# EAGLE design fonte_schema (EAGLE 9.6.2)
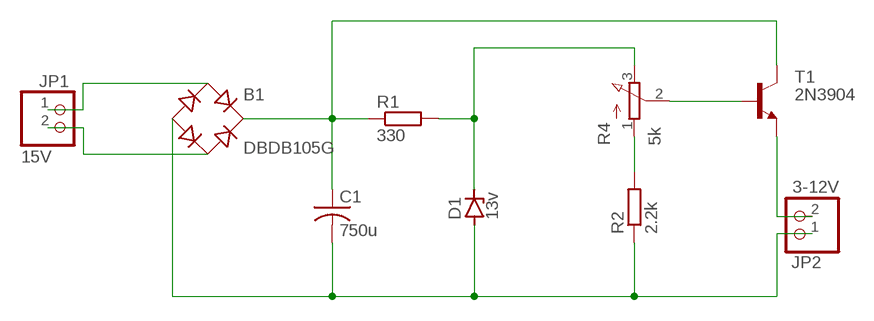
[diagram p0: schematic, sheet 1]

## Parts
B1  DBDB105G  [DB]
C1  750u  C-US025-025X050  [C025-025X050]
D1  13v  BZD23  [SOD81]
JP1  15V  PINHD-1X2  [1X02]
JP2  3-12V  PINHD-1X2  [1X02]
R1  330  R-EU_0204/7  [0204/7]
R2  2.2k  R-EU_0204/7  [0204/7]
R4  5k  3RP/1610N  [3RP/1610N]
T1  2N3904  [TO92]

## Nets
N$1: JP2.2 T1.3(E)
N$2: B1.AC1 JP1.1
N$3: B1.+ C1.1 R1.1 T1.1(C)
N$4: D1.C R1.2 R4.3(E)
N$5: B1.AC2 JP1.2
N$6: R4.2(S) T1.2(B)
N$7: R2.2 R4.1(A)
N$8: B1.- C1.2 D1.A JP2.1 R2.1

## Library data of the parts
B1 = rectifier:DB?*G: Single Phase 1.0 AMP Glass Passivated Bridge Rectifier Taiwan Semiconductor Co.,Ltd. - TSC Source: http://www.taiwansemi.com/TSCbig5/ezcatfiles/cust/img/img/db101g.pdf http://www.ts.com.tw/db/pictures/modules/PDT/PDT060207001/DBLS201G.pdf
C1 = rcl:C-US: CAPACITOR, American symbol; SPICEPREFIX: C
D1 = diode:BZD23: Z DIODE; SPICEPREFIX: D
JP1 JP2 = pinhead:PINHD-1X2: PIN HEADER; SPICEPREFIX: H
R1 R2 = rcl:R-EU_: RESISTOR, European symbol; SPICEPREFIX: R
R4 = pot:3RP/1610N: 16mm Potentiometer one level Source: http://www.alphapotentiometers.net/html/16mm_pot_2.html; SPICEPREFIX: J
T1 = transistor:2N3904: NPN TRANSISTOR; SPICEPREFIX: J

## Board
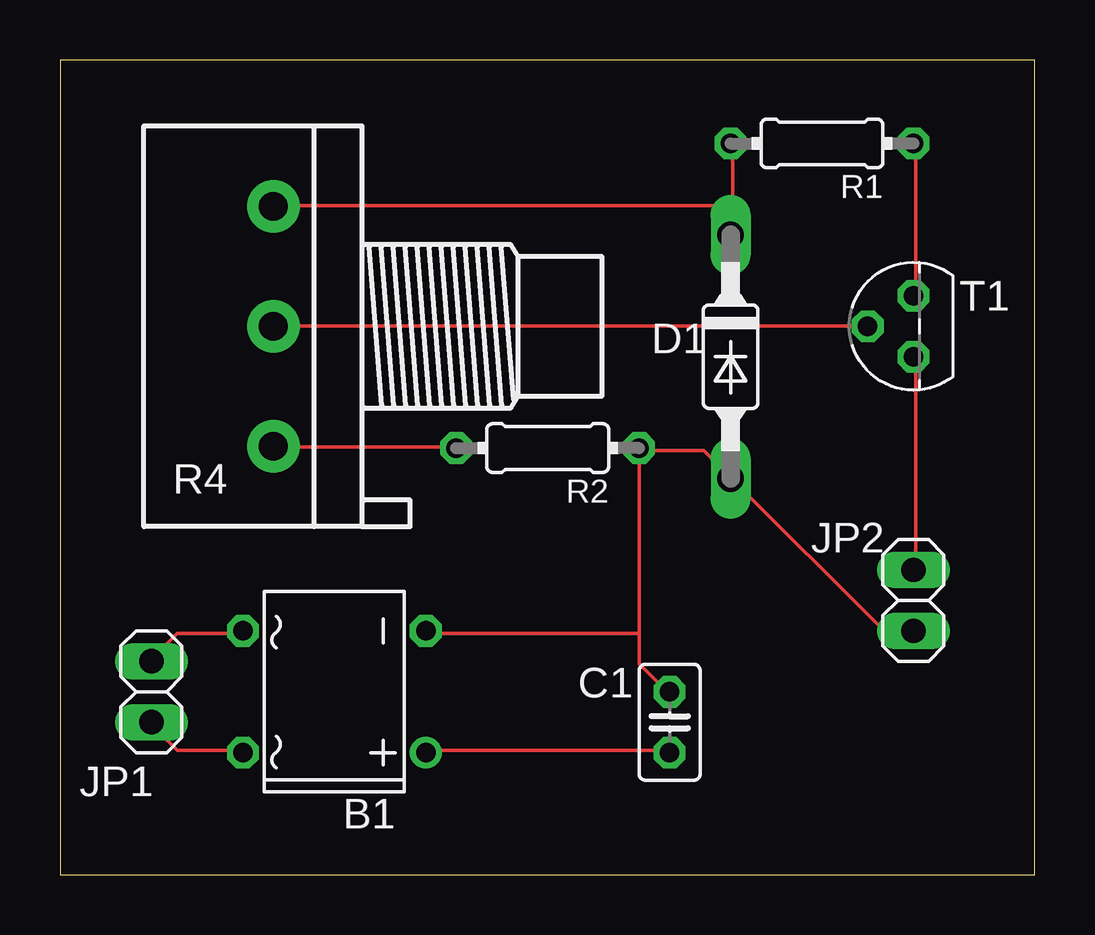
[diagram p1: board, top side]
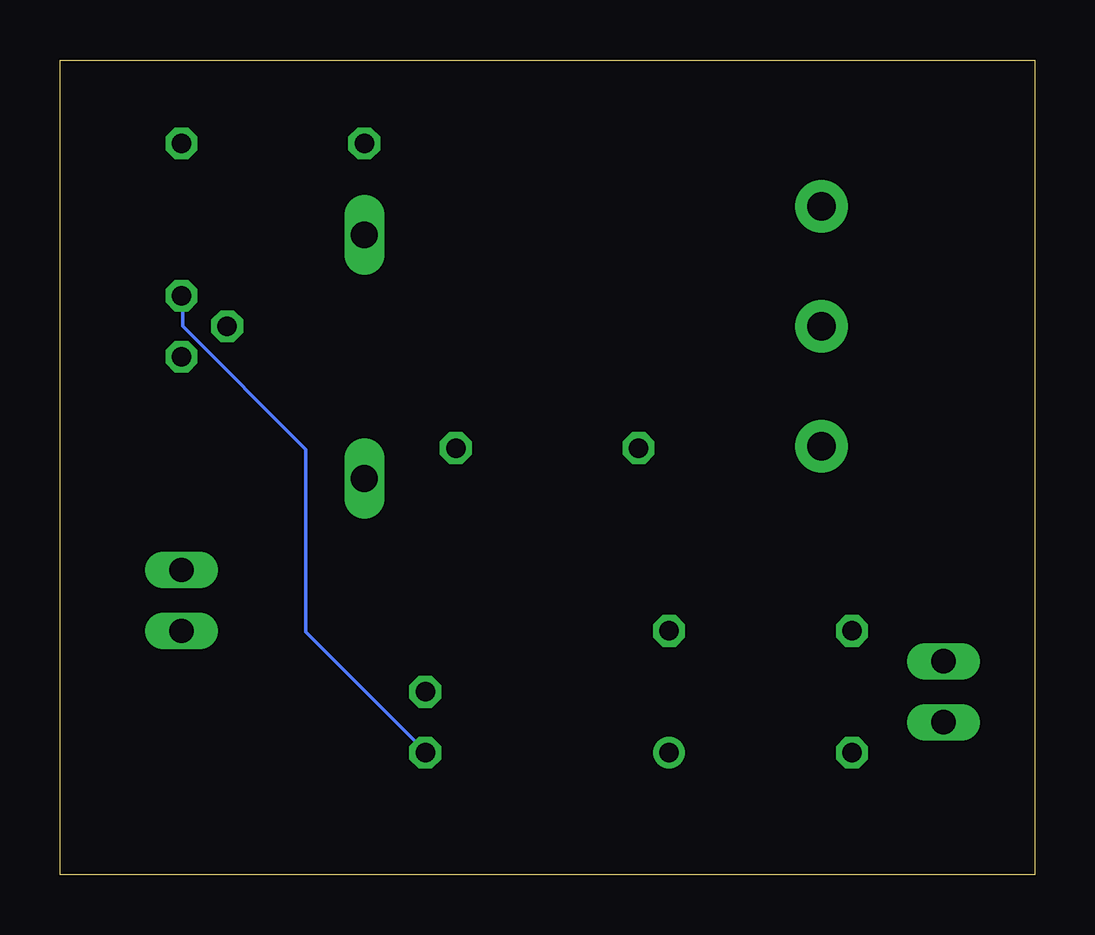
[diagram p2: board, bottom side, seen from below]

Size 40.62 x 33.96 mm. Coordinates in mm from the lower left corner, seen from the top.
Outline: 0,0 40.62,0 40.62,33.96 0,33.96 0,0
Copper layers (1*16): Top 0.035mm / dielectric 1.5mm / Bottom 0.035mm
Design rules "default": minimum track width 6mil, minimum drill 0.35mm, track to track 6mil, track to pad 6mil, pad to pad 6mil, via to via 6mil, smd to smd 6mil, copper to edge 40mil, drill to drill 6mil, minimum pad ring 10mil, minimum via ring 8mil, stop-mask expansion 4mil, vias tented up to drill 0mil, thermal gap 10mil

### Footprints (pad centres in the part's own frame; a part is rotated, then mirrored left to right if it is on the bottom)
DB = drill 0.813: + -2.54,-3.81 | drill 0.813 octagon: - 2.54,-3.81; AC1 2.54,3.81; AC2 -2.54,3.81
C025-025X050 = drill 0.813 octagon: 1 -1.27,0; 2 1.27,0
SOD81 = drill 1.118 long: A 5.08,0; C -5.08,0
1X02 = drill 1.016 long: 1 -1.27,0; 2 1.27,0
0204/7 = drill 0.813 octagon: 1 -3.81,0; 2 3.81,0
3RP/1610N = drill 1.2 pad 2.184: 1 -5,0; 2 0,0; 3 5,0
TO92 = drill 0.813 octagon: 1 1.27,0; 2 0,1.905; 3 -1.27,0

### Placement (x,y rotation side)
B1  11.43,7.62 90 top
C1  25.4,6.35 90 top
D1  27.94,21.59 270 top
JP1  3.81,7.62 270 top
JP2  35.56,11.43 90 top
R1  31.75,30.48 180 top
R2  20.32,17.78 180 top
R4  8.89,22.86 90 top
T1  35.56,22.86 90 top

### Tracks (layer width: path | path; a pad name or v marks a point on that pad's centre or on a via)
N$1
  Top 0.152: T1.3 35.66,21.49 35.66,12.8 JP2.2
N$2
  Top 0.152: B1.AC1 7.62,10.06 4.88,10.06 3.81,8.99 JP1.1
N$3
  Top 0.152: T1.1 35.66,24.23 35.66,30.48 R1.1 | B1.+ 15.24,5.18 25.3,5.18 C1.1
  Bottom 0.152: T1.1 35.51,24.08 35.51,22.86 30.38,17.73 30.38,10.11 25.45,5.18 C1.1
N$4
  Top 0.152: 28.04,27.89 28.04,26.67 D1.C 28.04,27.89 | 28.04,27.89 28.04,30.48 R1.2 | 28.04,27.89 8.99,27.89 R4.3
N$5
  Top 0.152: B1.AC2 7.62,5.18 4.88,5.18 3.81,6.25 JP1.2
N$6
  Top 0.152: R4.2 T1.2
N$7
  Top 0.152: R2.2 16.46,17.83 8.99,17.83 R4.1
N$8
  Top 0.152: 24.13,10.06 15.24,10.06 B1.- | C1.2 25.3,7.62 24.13,8.79 R2.1 24.23,17.68 26.82,17.68 27.89,16.61 D1.A 28.04,16.46 34.29,10.21 35.51,10.21 JP2.1